# EAGLE design Öffnungsmelder-101 (EAGLE 4.91)
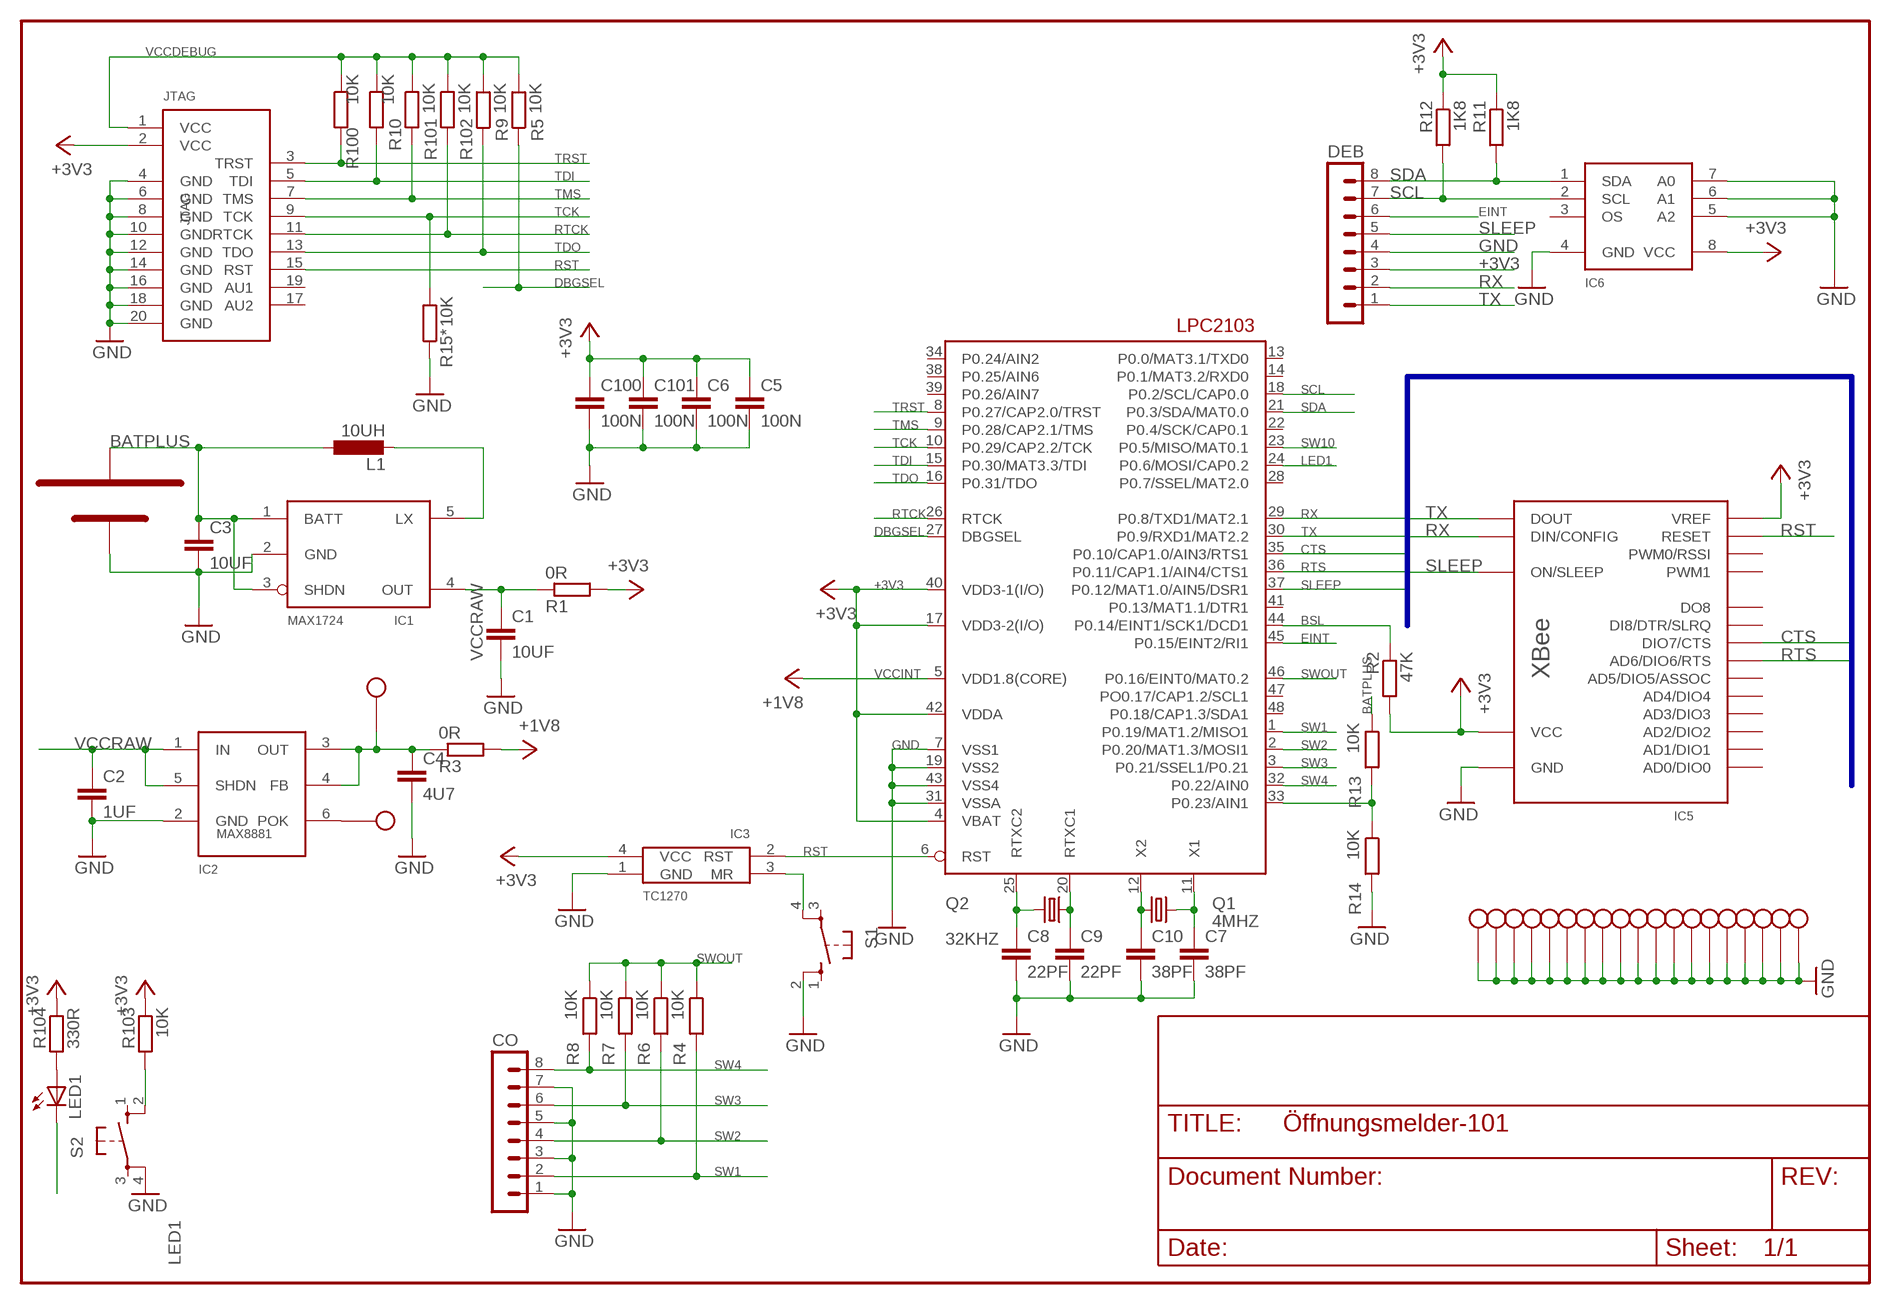
[diagram p0: schematic, sheet 1]

## Parts
$$GND1  STITCHVIA  [STITCHVIA]
$$GND2  STITCHVIA  [STITCHVIA]
$$GND3  STITCHVIA  [STITCHVIA]
$$GND4  STITCHVIA  [STITCHVIA]
$$GND5  STITCHVIA  [STITCHVIA]
$$GND6  STITCHVIA  [STITCHVIA]
$$GND7  STITCHVIA  [STITCHVIA]
$$GND8  STITCHVIA  [STITCHVIA]
$$GND9  STITCHVIA  [STITCHVIA]
$$GND10  STITCHVIA  [STITCHVIA]
$$GND11  STITCHVIA  [STITCHVIA]
$$GND12  STITCHVIA  [STITCHVIA]
$$GND13  STITCHVIA  [STITCHVIA]
$$GND14  STITCHVIA  [STITCHVIA]
$$GND15  STITCHVIA  [STITCHVIA]
BAT  BATTERY_SINGLECELL  [BATTERYHOLDER_AA_SINGLE]
C1  10UF  C-EUC0805  [C0805]
C2  1UF  C-EUC0805  [C0805]
C3  10UF  C-EUC0805  [C0805]
C4  4U7  C-EUC0805  [C0805]
C5  100N  C-EUC0805  [C0805]
C6  100N  C-EUC0805  [C0805]
C7  38PF  C-EUC0603  [C0603]
C8  22PF  C-EUC0805  [C0805]
C9  22PF  C-EUC0805  [C0805]
C10  38PF  C-EUC0603  [C0603]
C100  100N  C-EUC0805  [C0805]
C101  100N  C-EUC0805  [C0805]
CO  MA08-1  [MA08-1]
DEB  MA08-1  [MA08-1]
GND  STITCHVIA  [STITCHVIA]
IC1  MAX1724  [SOT23-5L]
IC2  MAX8881  [SOT23-6L]
IC3  TC1270  [SOT143R_INFINEON]
IC4  LPC2103  [LQFP48]
IC5  XBEE  [XBEE]
IC6  SE95  [MSOP8]
JTAG  ARM-JTAGVERTIKAL  [ML20]
L1  10UH  L-EU  [L2634MURATA]
LED1  LEDCHIP-LED0805  [CHIP-LED0805]
Q1  4MHZ  CRYTALHC49S  [HC49/S]
Q2  32KHZ  CRYTALTC26V  [TC26V]
R1  0R  R-EU_M0805  [M0805]
R2  47K  R-EU_M0805  [M0805]
R3  0R  R-EU_M0805  [M0805]
R4  10K  R-EU_M0805  [M0805]
R5  10K  R-EU_M0805  [M0805]
R6  10K  R-EU_M0805  [M0805]
R7  10K  R-EU_M0805  [M0805]
R8  10K  R-EU_M0805  [M0805]
R9  10K  R-EU_M0805  [M0805]
R10  10K  R-EU_M0805  [M0805]
R11  1K8  R-EU_M0805  [M0805]
R12  1K8  R-EU_M0805  [M0805]
R13  10K  R-EU_M0805  [M0805]
R14  10K  R-EU_M0805  [M0805]
R15*  10K  R-EU_M0805  [M0805]
R100  10K  R-EU_M0805  [M0805]
R101  10K  R-EU_M0805  [M0805]
R102  10K  R-EU_M0805  [M0805]
R103  10K  R-EU_M0805  [M0805]
R104  330R  R-EU_M0805  [M0805]
S1  10XX  [B3F-10XX]
S2  10XX  [B3F-10XX]
U$1  STITCHVIA  [STITCHVIA]
U$2  STITCHVIA  [STITCHVIA]
U$3  STITCHVIA  [STITCHVIA]
U$4  STITCHVIA  [STITCHVIA]
U$5  STITCHVIA  [STITCHVIA]

## Nets
+3V3: C5.1 C6.1 C100.1 C101.1 DEB.3 IC3.4(VCC) IC4.4(VBAT) IC4.17(VDD3-2(I/O)) IC4.40(VDD3-1(I/O)) IC4.42(VDDA) IC5.1(VCC) IC5.14(VREF) IC6.8(VCC) JTAG.2(VCC) R1.2 R2.2 R11.1 R12.1 R103.1 R104.1
BATPLUS: BAT.VCC C3.1 IC1.1(BATT) IC1.3(SHDN) L1.P$1 R13.1
BSL: IC4.44(P0.14/EINT1/SCK1/DCD1) R2.1
CTS: IC4.35(P0.10/CAP1.0/AIN3/RTS1) IC5.12(DIO7/CTS)
DBGSEL: IC4.27(DBGSEL) R5.1
EINT: DEB.6 IC4.45(P0.15/EINT2/RI1)
GND: $$GND1.1(GND) $$GND2.1(GND) $$GND3.1(GND) $$GND4.1(GND) $$GND5.1(GND) $$GND6.1(GND) $$GND7.1(GND) $$GND8.1(GND) $$GND9.1(GND) $$GND12.1(GND) $$GND13.1(GND) $$GND14.1(GND) $$GND15.1(GND) BAT.GND C1.2 C2.2 C3.2 C4.2 C5.2 C6.2 C7.2 C8.2 C9.2 C10.2 C100.2 C101.2 CO.1 CO.3 CO.5 CO.7 DEB.4 GND.1(GND) IC1.2(GND) IC2.2(GND) IC3.1(GND) IC4.7(VSS1) IC4.19(VSS2) IC4.31(VSSA) IC4.43(VSS4) IC5.10(GND) IC6.4(GND) IC6.5(A2) IC6.6(A1) IC6.7(A0) JTAG.4(GND) JTAG.6(GND) JTAG.8(GND) JTAG.10(GND) JTAG.12(GND) JTAG.14(GND) JTAG.16(GND) JTAG.18(GND) JTAG.20(GND) R14.2 R15*.1 S1.2 S2.4 U$1.1(GND) U$2.1(GND) U$3.1(GND) U$4.1(GND) U$5.1(GND)
LED1: IC4.24(P0.6/MOSI/CAP0.2) LED1.C
LX: IC1.5(LX) L1.P$2
MANRST: IC3.3(MR) S1.4
N$1: IC4.33(P0.23/AIN1) R13.2 R14.1
N$2: $$GND11.1(GND) IC2.6(POK)
N$14: LED1.A R104.2
RST: IC3.2(RST) IC4.6(RST) IC5.5(RESET) JTAG.15(RST)
RTCK: IC4.26(RTCK) JTAG.11(RTCK) R102.2
RTS: IC4.36(P0.11/CAP1.1/AIN4/CTS1) IC5.16(AD6/DIO6/RTS)
RTXC1: C9.1 IC4.20(RTXC1) Q2.1
RTXC2: C8.1 IC4.25(RTXC2) Q2.2
RX: DEB.2 IC4.29(P0.8/TXD1/MAT2.1) IC5.3(DIN/CONFIG)
SCL: DEB.7 IC4.18(P0.2/SCL/CAP0.0) IC6.2(SCL) R12.2
SDA: DEB.8 IC4.21(P0.3/SDA/MAT0.0) IC6.1(SDA) R11.2
SLEEP: DEB.5 IC4.37(P0.12/MAT1.0/AIN5/DSR1) IC5.13(ON/SLEEP)
SW1: CO.2 IC4.1(P0.19/MAT1.2/MISO1) R4.2
SW2: CO.4 IC4.2(P0.20/MAT1.3/MOSI1) R6.2
SW3: CO.6 IC4.3(P0.21/SSEL1/P0.21) R7.2
SW4: CO.8 IC4.32(P0.22/AIN0) R8.2
SW10: IC4.23(P0.5/MISO/MAT0.1) R103.2 S2.2
SWOUT: IC4.46(P0.16/EINT0/MAT0.2) R4.1 R6.1 R7.1 R8.1
TCK: IC4.10(P0.29/CAP2.2/TCK) JTAG.9(TCK) R15*.2
TDI: IC4.15(P0.30/MAT3.3/TDI) JTAG.5(TDI) R10.2
TDO: IC4.16(P0.31/TDO) JTAG.13(TDO) R9.1
TMS: IC4.9(P0.28/CAP2.1/TMS) JTAG.7(TMS) R101.2
TRST: IC4.8(P0.27/CAP2.0/TRST) JTAG.3(TRST) R100.2
TX: DEB.1 IC4.30(P0.9/RXD1/MAT2.2) IC5.2(DOUT)
VCCDEBUG: JTAG.1(VCC) R5.2 R9.2 R10.1 R100.1 R101.1 R102.1
VCCINT: IC4.5(VDD1.8(CORE)) R3.2 ; supply symbol labelled +1V8
VCCINTREG: $$GND10.1(GND) C4.1 IC2.3(OUT) IC2.4(FB) R3.1
VCCRAW: C1.1 C2.1 IC1.4(OUT) IC2.1(IN) IC2.5(SHDN) R1.1
X1: C7.1 IC4.11(X1) Q1.2
X2: C10.1 IC4.12(X2) Q1.1
Unconnected: IC4.13(P0.0/MAT3.1/TXD0) IC4.14(P0.1/MAT3.2/RXD0) IC4.22(P0.4/SCK/CAP0.1) IC4.28(P0.7/SSEL/MAT2.0) IC4.34(P0.24/AIN2) IC4.38(P0.25/AIN6) IC4.39(P0.26/AIN7) IC4.41(P0.13/MAT1.1/DTR1) IC4.47(PO0.17/CAP1.2/SCL1) IC4.48(P0.18/CAP1.3/SDA1) IC5.4(DO8) IC5.6(PWM0/RSSI) IC5.7(PWM1) IC5.9(DI8/DTR/SLRQ) IC5.11(AD4/DIO4) IC5.15(AD5/DIO5/ASSOC) IC5.17(AD3/DIO3) IC5.18(AD2/DIO2) IC5.19(AD1/DIO1) IC5.20(AD0/DIO0) IC6.3(OS) JTAG.17(AU2) JTAG.19(AU1) S1.1 S1.3 S2.1 S2.3

## Buses
SLEEP,RX,TX,CTS,RTS

## Library data of the parts
$$GND1-$$GND15 GND U$1-U$5 = turbod3:STITCHVIA
BAT = turbod3:BATTERY_SINGLECELL
C1-C10 C100 C101 = turbod3:C-EU: CAPACITOR, European symbol
CO DEB = con-lstb:MA08-1: PIN HEADER
IC1 = turbod3:MAX1724
IC2 = turbod3:MAX8881
IC3 = turbod3:TC1270
IC4 = turbod3:LPC2103: LPC2101/2102/2103 microcontroler from Philips
IC5 = turbod3:XBEE
IC6 = turbod3:SE95
JTAG = turbod3:ARM-JTAG
L1 = turbod3:L-EU: INDUCTOR, European symbol
LED1 = led:LED: LED OSRAM: - CHIPLED LG R971, LG N971, LY N971, LG Q971, LY Q971, LO R971, LY R971 LH N974, LH R974 LS Q976, LO Q976, LY Q976 LO Q996 - Hyper CHIPLED LW Q18S LB Q993, LB Q99A, LB R99A - SideLED LS A670, LO A670, LY A670, LG A670, LP A670 LB A673, LV A673, LT A673, LW A673 LH A674 LY A675 LS A676, LA A676, LO A676, LY A676, LW A676 LS A679, LY A679, LG A679 - Hyper Micro SIDELED® LS Y876, LA Y876, LO Y876, LY Y876 LT Y87S - SmartLED LW L88C, LW L88S LB L89C, LB L89S, LG L890 LS L89K, LO L89K, LY L89K LS L896, LA L896, LO L896, LY L896 - TOPLED LS T670, LO T670, LY T670, LG T670, LP T670 LSG T670, LSP T670, LSY T670, LOP T670, LYG T670 LG T671, LOG T671, LSG T671 LB T673, LV T673, LT T673, LW T673 LH T674 LS T676, LA T676, LO T676, LY T676, LB T676, LH T676, LSB T676, LW T676 LB T67C, LV T67C, LT T67C, LS T67K, LO T67K, LY T67K, LW E67C LS E67B, LA E67B, LO E67B, LY E67B, LB E67C, LV E67C, LT E67C LW T67C LS T679, LY T679, LG T679 LS T770, LO T770, LY T770, LG T770, LP T770 LB T773, LV T773, LT T773, LW T773 LH T774 LS E675, LA E675, LY E675, LS T675 LS T776, LA T776, LO T776, LY T776, LB T776 LHGB T686 LT T68C, LB T68C - Hyper Mini TOPLED® LB M676 - Mini TOPLED Santana® LG M470 LS M47K, LO M47K, LY M47K Source: http://www.osram.convergy.de/
Q1 Q2 = turbod3:CRYTAL: CRYSTAL
R1-R14 R15* R100-R104 = turbod3:R-EU_: RESISTOR, European symbol
S1 S2 = KEY_B:10XX

## Board
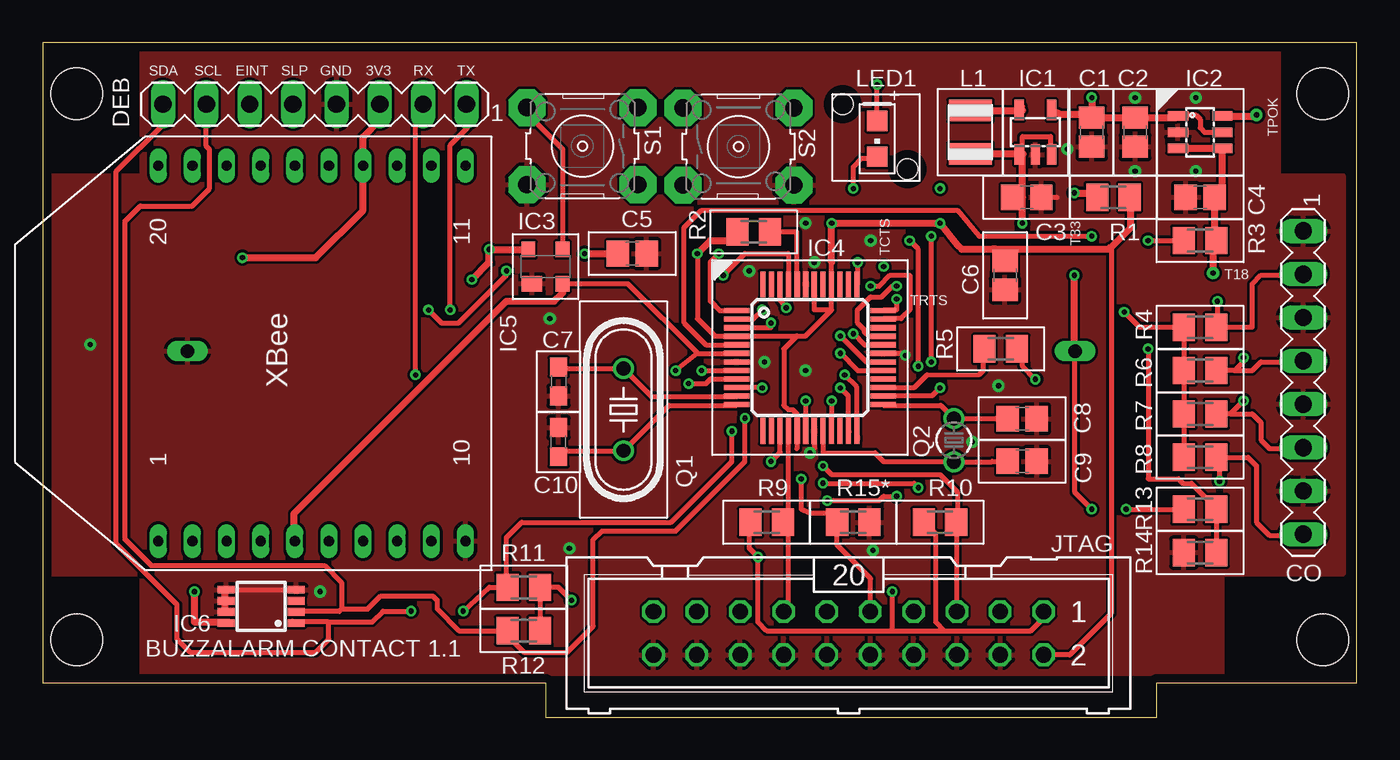
[diagram p1: board, top side]
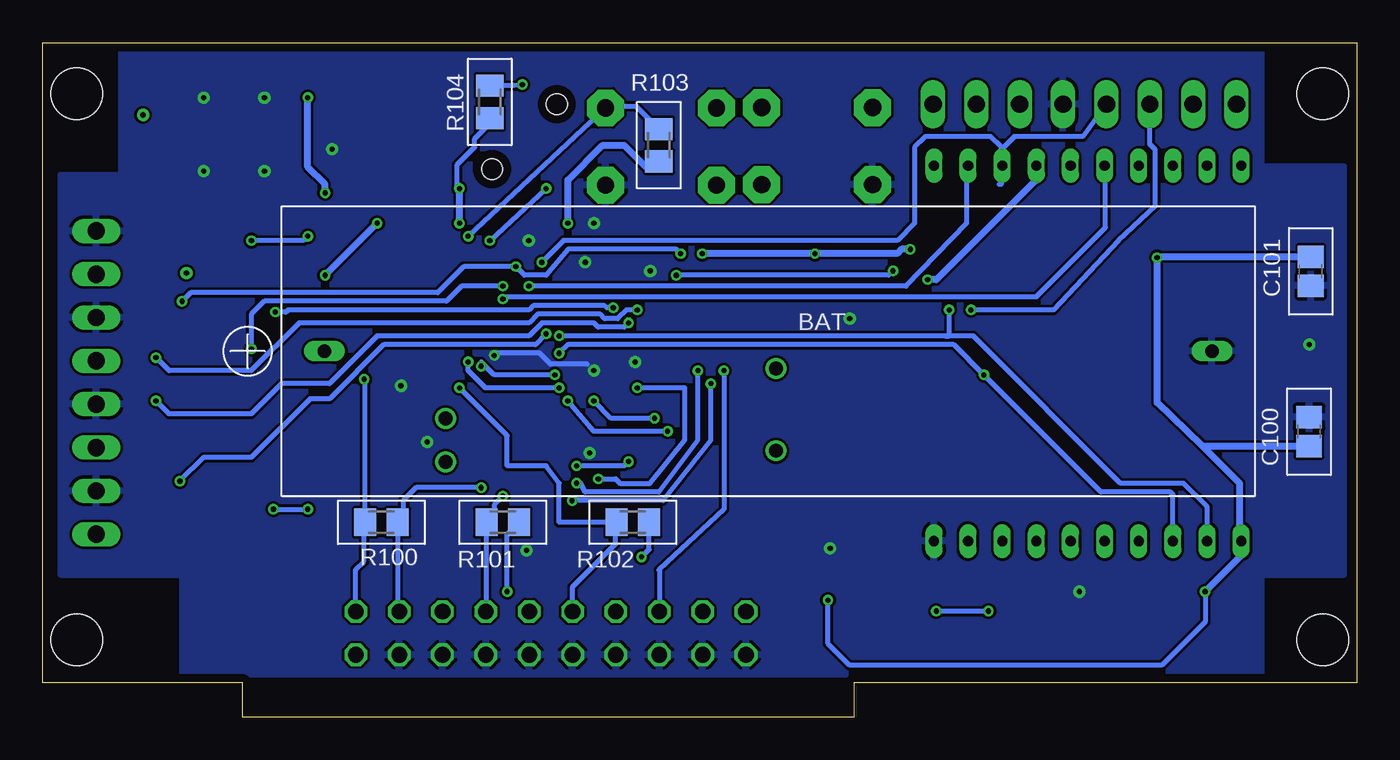
[diagram p2: board, bottom side, seen from below]

Size 77 x 39.54 mm. Coordinates in mm from the lower left corner, seen from the top.
Outline: 0,2.03 29.46,2.03 29.46,0 65.28,0 65.28,2.03 77,2.03 77,39.54 0,39.54 0,2.03
Copper layers (1*16): Top 0.035mm / dielectric 1.5mm / Bottom 0.035mm
Design rules "PCB-POOL": minimum track width 6mil, minimum drill 12mil, track to track 6mil, track to pad 6mil, pad to pad 6mil, via to via 6mil, smd to smd 6mil, copper to edge 20mil, drill to drill 8mil, minimum pad ring 8mil, minimum via ring 6mil, stop-mask expansion 3mil, vias tented up to drill 0mil, thermal gap 8mil
Holes 3 mm at 2,36.54 2,4.54 75,36.54 75,4.54

### Footprints (pad centres in the part's own frame; a part is rotated, then mirrored left to right if it is on the bottom)
STITCHVIA = drill 0.305 pad 0.61 round: 1 0,0
BATTERYHOLDER_AA_SINGLE = drill 0.8 pad 1 long: GND -26.5,0.5; VCC 25.5,0.5
C0805 = smd 1.3 x 1.5: 1 -0.85,0; 2 0.85,0
C0603 = smd 1.1 x 1: 1 -0.85,0; 2 0.85,0
MA08-1 = drill 1.016 long: 1 -8.89,0; 2 -6.35,0; 3 -3.81,0; 4 -1.27,0; 5 1.27,0; 6 3.81,0; 7 6.35,0; 8 8.89,0
SOT23-5L = smd 0.55 x 1.2: 1 -0.95,-1.3; 2 0,-1.3; 3 0.95,-1.3; 4 0.95,1.3; 5 -0.95,1.3
SOT23-6L = smd 0.55 x 1.2: 1 -0.95,-1.3; 2 0,-1.3; 3 0.95,-1.3; 4 0.95,1.3; 5 0,1.3; 6 -0.95,1.3
SOT143R_INFINEON = smd 1.2 x 0.9: 1 -0.8,-1 | smd 0.8 x 0.9: 2 1,-1; 3 1,1; 4 -1,1
LQFP48 = smd 1.5 x 0.3: 1 -4.3,2.75; 2 -4.3,2.25; 3 -4.3,1.75; 4 -4.3,1.25; 5 -4.3,0.75; 6 -4.3,0.25; 7 -4.3,-0.25; 8 -4.3,-0.75; 9 -4.3,-1.25; 10 -4.3,-1.75; 11 -4.3,-2.25; 12 -4.3,-2.75; 25 4.3,-2.75; 26 4.3,-2.25; 27 4.3,-1.75; 28 4.3,-1.25; 29 4.3,-0.75; 30 4.3,-0.25; 31 4.3,0.25; 32 4.3,0.75; 33 4.3,1.25; 34 4.3,1.75; 35 4.3,2.25; 36 4.3,2.75 | smd 0.3 x 1.5: 13 -2.75,-4.3; 14 -2.25,-4.3; 15 -1.75,-4.3; 16 -1.25,-4.3; 17 -0.75,-4.3; 18 -0.25,-4.3; 19 0.25,-4.3; 20 0.75,-4.3; 21 1.25,-4.3; 22 1.75,-4.3; 23 2.25,-4.3; 24 2.75,-4.3; 37 2.75,4.3; 38 2.25,4.3; 39 1.75,4.3; 40 1.25,4.3; 41 0.75,4.3; 42 0.25,4.3; 43 -0.25,4.3; 44 -0.75,4.3; 45 -1.25,4.3; 46 -1.75,4.3; 47 -2.25,4.3; 48 -2.75,4.3
XBEE = drill 0.6 long: 1 -11,17; 2 -11,15; 3 -11,13; 4 -11,11; 5 -11,9; 6 -11,7; 7 -11,5; 8 -11,3; 9 -11,1; 10 -11,-1; 11 11,-1; 12 11,1; 13 11,3; 14 11,5; 15 11,7; 16 11,9; 17 11,11; 18 11,13; 19 11,15; 20 11,17
MSOP8 = smd 0.45 x 1: 1 -0.975,-2.05; 2 -0.325,-2.05; 3 0.325,-2.05; 4 0.975,-2.05; 5 0.975,2.05; 6 0.325,2.05; 7 -0.325,2.05; 8 -0.975,2.05
ML20 = drill 0.914 octagon: 1 -11.43,-1.27; 2 -11.43,1.27; 3 -8.89,-1.27; 4 -8.89,1.27; 5 -6.35,-1.27; 6 -6.35,1.27; 7 -3.81,-1.27; 8 -3.81,1.27; 9 -1.27,-1.27; 10 -1.27,1.27; 11 1.27,-1.27; 12 1.27,1.27; 13 3.81,-1.27; 14 3.81,1.27; 15 6.35,-1.27; 16 6.35,1.27; 17 8.89,-1.27; 18 8.89,1.27; 19 11.43,-1.27; 20 11.43,1.27
L2634MURATA = smd 1.27 x 2.54: P$1 -1.27,0; P$2 1.27,0
CHIP-LED0805 = smd 1.2 x 1.2: A 0,-1.05; C 0,1.05
HC49/S = drill 0.813 round: 1 -2.413,0; 2 2.413,0
TC26V = drill 0.813 round: 1 -1.27,0; 2 1.27,0
M0805 = smd 1.3 x 1.6: 1 -0.95,0; 2 0.95,0
B3F-10XX = drill 1.016 pad 2.159 octagon: 1 -3.379,2.312; 2 3.123,2.312; 3 -3.379,-2.209; 4 3.123,-2.209
LIGHTPIPE1 = hole 1.2: -2.4,2.4; 1.4,-1.4

### Placement (x,y rotation side)
$$GND1  64.01,36.32 0 top
$$GND2  67.56,36.32 0 top
$$GND3  60.04,33.3 90 top
$$GND4  64.01,32 90 top
$$GND5  67.56,32 90 top
$$GND6  44.7,20.32 0 top
$$GND7  54.48,16.13 0 top
$$GND8  30.86,9.91 0 top
$$GND9  48.64,9.78 0 top
$$GND10  68.58,26.04 0 top
$$GND11  71.12,35.31 0 top
$$GND12  41.4,26.16 0 top
$$GND13  45.21,26.67 0 top
$$GND14  29.72,23.37 0 top
$$GND15  48.51,27.94 0 top
BAT  34.99,21.95 180 bottom
C1  61.47,34.29 270 top
C2  64.01,34.29 270 top
C3  57.66,30.48 0 top
C4  67.82,30.48 180 top
C5  34.54,27.18 0 top
C6  56.39,25.91 270 top
C7  30.23,19.68 270 top
C8  57.39,17.5 0 top
C9  57.39,15.01 0 top
C10  30.23,16.13 90 top
C100  2.8,16.74 90 bottom
C101  2.7,26.14 270 bottom
CO  73.86,19.62 270 top
DEB  15.94,35.93 180 top
GND  44.96,15.49 0 top
IC1  58.17,34.29 0 top
IC2  67.82,34.29 270 top
IC3  29.46,26.42 0 top
IC4  44.96,21.08 0 top
IC5  23.77,21.33 90 top
IC6  12.8,6.5 90 top
JTAG  47.22,4.93 180 top
L1  54.36,34.29 90 top
LED1  48.9,33.91 180 top
Q1  34.04,18.03 90 top
Q2  53.39,16.24 90 top
R1  62.74,30.48 0 top
R2  41.66,28.45 180 top
R3  67.82,27.94 180 top
R4  67.82,22.86 0 top
R5  56.13,21.59 0 top
R6  67.82,20.32 0 top
R7  67.82,17.78 0 top
R8  67.82,15.24 0 top
R9  42.42,11.43 180 top
R10  52.58,11.43 0 top
R11  28.19,7.62 180 top
R12  28.19,5.08 180 top
R13  67.82,12.19 0 top
R14  67.82,9.65 180 top
R15*  47.5,11.43 180 top
R100  57.15,11.43 0 bottom
R101  50.04,11.43 180 bottom
R102  42.42,11.43 180 bottom
R103  40.89,33.53 90 bottom
R104  50.8,36.07 90 bottom
S1  31.5,33.53 180 top
S2  40.89,33.4 0 top
U$1  44.7,28.96 0 top
U$2  42.29,20.83 0 top
U$3  2.79,21.84 0 top
U$4  56.01,19.43 0 top
U$5  16.26,7.37 0 top
U$6  [LIGHTPIPE1]  49.28,33.53 0 top

### Tracks (layer width: path | path; a pad name or v marks a point on that pad's centre or on a via)
+3V3  (via drill 0.3)
  Top 0.305: 46.23,23.88 44.7,22.35 44.2,22.35 | IC4.42 45.21,25.4 | IC4.42 | IC4.42 | IC4.42 45.21,23.88 46.23,23.88 | IC4.40 46.23,25.4 | 46.23,23.88 46.23,25.4 | 44.2,22.35 40.68,22.35 IC4.4 39.39,22.33 38.35,23.37 v38.35,27.18 | 44.2,16.79 IC4.17 44.2,16.77 | 44.2,16.77 44.2,16.76 | 44.2,16.77 44.2,17.78 43.94,18.03 43.69,18.03 43.43,18.29 43.43,21.59 44.2,22.35 | 44.2,16.77 44.2,15.75 | 46.23,25.4 46.23,26.67 | R12.1 29.21,5.33 29.14,5.4 R11.1 30.23,7.62 v30.99,6.86 | JTAG.2 60.17,3.66 62.61,6.1 62.61,27.43 62.55,27.5 62.48,27.56 | 26.18,27.42 26.18,27.19 v26.16,27.43
  Top 0.406: 46.23,26.67 v46.23,28.96 v52.58,28.96 53.59,27.69 53.85,27.43 55.88,27.43 | v31.75,27.18 C5.1 | DEB.3 19.75,35.11 19.81,35.05 18.77,34.01 18.77,31.47 | 18.77,31.47 IC5.14 | 18.77,31.47 18.77,29.7 16,26.94 v11.7,26.94 | v8.89,7.37 8.89,5.59 10.92,5.59 10.86,5.53 IC6.8 | v38.35,27.18 39.12,27.94 40.64,27.94 40.71,28.01 R2.2 | 55.88,27.43 62.48,27.43 62.55,27.5 63.75,28.7 63.75,30.48 R1.2 | 55.88,27.43 55.63,27.43 | 26.18,27.42 IC3.4 | v26.16,27.43 26.16,26.67 v25.15,25.65 | C6.1 56.39,26.92 55.88,27.43
  Bottom 0.305: v30.99,6.86 30.99,4.32 29.72,3.05 11.43,3.05 8.89,5.59 v8.89,7.37 | v52.58,30.99 52.7,30.86 52.7,32.38 51.69,33.4 51.69,33.91 50.93,34.67 50.87,34.61 R104.1
  Bottom 0.406: v52.58,28.96 v52.58,30.99 | v46.23,28.96 46.23,31.5 44.2,33.53 42.93,33.53 41.66,32.26 41.15,32.26 40.89,32.51 R103.1 | v26.16,27.43 26.67,27.43 26.92,27.18 v31.75,27.18 v38.35,27.18 | IC5.14 18.77,31.47 18.8,31.5 24.64,25.65 v25.15,25.65 | v8.89,7.37 6.77,9.48 IC5.1 6.86,10.41 6.86,13.72 9.06,15.91 | 9.06,15.91 C100.1 | 9.06,15.91 11.7,18.44 v11.7,26.94 11.7,26.99 C101.1
BATPLUS  (via drill 0.3, 0.3 pad 0.61)
  Top 0.305: 57.44,33.02 IC1.1 57.4,32.92 | 57.4,32.99 57.4,34.04 59.05,34.04 59.05,32.99 | BAT.VCC 60.49,13.17 v61.47,12.19 | 66.93,12.19 R13.1 v63.48,12.19 | 59.05,32.99 59.05,32.77 | 59.05,32.99 IC1.3
  Top 0.406: 57.44,33.02 L1.P$1 | 57.4,30.48 57.4,32.92 | 57.4,30.48 C3.1 | v57.4,28.96 57.4,30.48 | IC1.1 57.4,32.99 | BAT.VCC 60.49,21.55 60.45,21.59 v60.45,25.91
  Bottom 0.305: v63.48,12.19 v61.47,12.19
  Bottom 0.406: v60.45,25.91 v57.4,28.96
BSL
  Top 0.305: IC4.44 44.2,25.39 44.2,28.45 R2.1
CTS  (via drill 0.3)
  Top 0.305: IC4.35 49.28,23.35 49.28,23.37 50.29,23.37 50.8,23.88 50.8,25.91 49.66,25.91 49.02,25.27 v48.51,25.27
  Bottom 0.305: IC5.12 22.86,31.35 22.86,28.96 26.42,25.27 v48.51,25.27
DBGSEL
  Top 0.305: IC4.27 51.08,19.33 51.82,20.07 54.89,20.09 55.12,20.32 55.12,21.84 R5.1
EINT  (via drill 0.3)
  Top 0.305: IC4.45 43.71,26.4 43.69,27.18 41.15,27.18 v39.88,25.91 | 12.19,35.81 12.13,35.88 DEB.6 | v27.18,26.16 27.18,25.91 24.38,23.11 23.37,23.11 v22.61,23.88
  Bottom 0.305: v39.88,25.91 27.43,25.91 v27.18,26.16 | DEB.6 12.13,33.59 11.81,33.27 11.81,29.97 13.97,27.94 17.78,23.88 v22.61,23.88
GND  (via drill 0.3)
  Top 0.305: C3.2 59.44,30.48 | IC6.5 14.94,7.48 | C1.2 61.47,33.53 60.86,32.92 | IC4.19 45.21,15.75 | IC4.31 50.67,21.33 v50.55,21.21
  Top 0.406: 14.94,7.42 14.88,7.48 IC6.4 14.94,7.48 | 10.67,6.83 10.67,6.81 | IC6.5 10.67,7.48 10.67,6.83 | IC6.7 10.67,6.18 10.67,6.83 | 10.67,6.83 IC6.6
  Bottom 0.305: v50.55,21.21 50.42,21.21 50.29,21.34 47.88,21.34 47.24,20.7 45.09,20.7
  pour Top: 0.51,31.75 5.84,31.75 5.84,39.08 72.39,39.08 72.39,31.75 76.2,31.75 76.2,8.38 69.09,8.38 69.09,2.54 5.84,2.54 5.84,8.38 0.51,8.38
  pour Bottom: 0.76,8.38 0.76,32.26 5.59,32.26 5.59,39.08 72.39,39.08 72.39,31.75 75.95,31.75 75.95,8.38 68.83,8.38 68.83,2.54 5.59,2.54 5.59,8.38 6.35,8.38
LED1  (via drill 0.3, 0.3 pad 0.61)
  Top 0.305: 47.73,16.26 IC4.24 47.71,19.35 v46.99,20.07 | v47.5,30.99 47.5,32.26 48.01,32.77 48.77,32.77 48.86,32.86 LED1.C | v50.8,27.94 51.31,27.43 v51.31,20.57
  Bottom 0.305: v50.8,27.94 v47.5,30.99 | v46.99,20.07 50.55,20.07 51.31,20.83 v51.31,20.57
LX
  Top 0.305: 57.4,35.66 IC1.5 | 57.4,35.66 57.4,35.81 | 57.4,35.56 57.4,35.66
  Top 0.406: L1.P$2 57.4,35.56
MANRST
  Top 0.305: IC3.3 30.48,27.43 30.48,33.27 28.45,35.31 28.45,35.81 | 28.45,35.81 | 28.45,35.81 S1.4
N$1  (via drill 0.3)
  Top 0.305: v64.77,21.59 64.77,13.97 66.55,13.97 66.8,13.72 67.31,13.72 68.83,12.19 R13.2 68.77,9.72 68.83,9.65 R14.1 | v50.04,25.27 49.78,25.27 49.15,24.64 48.51,24.64 47.75,23.88 47.75,23.11 48.13,22.73 48.13,22.61 48.41,22.33 IC4.33
  Bottom 0.305: v64.77,21.59 64.77,23.62 64.01,24.38 53.34,24.38 52.45,25.27 v50.04,25.27
N$2
  Top 0.406: 71.12,35.24 $$GND11.1 | IC2.6 71.12,35.24 | 71.12,35.24 71.12,35.18
N$14  (via drill 0.3)
  Top 0.305: LED1.A v48.9,37.08
  Bottom 0.305: R104.2 49.4,37.02 v48.9,37.08
RST  (via drill 0.3)
  Top 0.305: 38.35,21.33 IC4.6 | 38.35,21.33 v37.08,20.32 | 38.35,21.33 38.35,21.34 34.27,25.42 IC3.2
  Top 0.406: IC3.2 30.46,24.88 29.97,24.38 27.18,24.38 14.73,11.94 14.73,10.41 14.77,10.37 IC5.5
  Bottom 0.305: 40.87,8.66 40.89,8.64 | 40.87,8.66 JTAG.15 | v37.08,20.32 37.08,12.19 40.87,8.66
RTCK  (via drill 0.3)
  Top 0.305: IC4.26 52.11,18.83 v52.58,19.3
  Bottom 0.305: JTAG.11 45.95,7.64 43.43,10.16 43.43,11.43 | 43.43,11.43 R102.2 | v52.58,19.3 49.78,16.51 49.78,14.73 47.5,14.73 46.74,13.72 46.74,11.43 43.43,11.43
RTS  (via drill 0.3)
  Top 0.305: IC4.36 49.3,23.88 50.04,23.88 v50.04,24.51
  Bottom 0.305: IC5.16 14.73,31.39 14.73,28.7 18.8,24.64 49.91,24.64 v50.04,24.51
RTXC1
  Top 0.305: IC4.20 45.72,15.49 48.77,15.49 49.28,14.99 52.9,14.99 Q2.1 55.61,14.97 55.65,15.01 C9.1
RTXC2
  Top 0.305: IC4.25 49.28,18.31 49.28,18.29 52.62,18.29 Q2.2 55.87,17.51 | 55.87,17.51 55.85,17.5 C8.1 | 55.87,17.51 55.88,17.53
RX  (via drill 0.3)
  Top 0.305: 22.29,35.24 22.35,35.31 | 22.29,35.24 DEB.2 | v21.84,20.07 21.84,34.8 22.29,35.24 | IC4.29 49.28,20.32 | IC4.29 | v46.74,21.34 47.75,20.32 IC4.29
  Bottom 0.305: IC5.3 10.77,13.06 10.92,13.21 14.99,13.21 v21.84,20.07 23.62,21.84 46.23,21.84 v46.74,21.34
SCL  (via drill 0.3)
  Top 0.305: R12.2 24.38,5.08 23.11,6.35 23.11,6.86 22.86,7.11 19.81,7.11 19.05,6.35 17.53,6.35 | 17.53,6.35 17.37,6.2 14.83,6.2 | 27.24,4.76 28.19,3.81 30.73,3.81 32.26,5.33 32.26,10.41 32.77,10.92 37.08,10.92 41.15,14.99 v41.15,17.53 | 17.53,6.35 17.53,7.87 16.51,8.89 6.35,8.89 4.83,10.41 4.83,29.08 5.71,29.97 8.76,29.97 9.78,30.99 9.78,33.27 9.59,33.46 DEB.7 | IC4.18 v44.71,18.54 v44.7,18.54
  Top 0.406: 14.87,6.2 IC6.2 14.83,6.2 14.63,6.2 | R12.2 27.24,4.76
  Bottom 0.305: v41.15,17.53 43.69,17.53 v44.7,18.54
SDA  (via drill 0.3)
  Top 0.305: v21.59,6.22 19.94,6.22 19.3,5.59 16.76,5.59 | v24.64,6.22 26.16,7.62 R11.2 | 16.76,5.59 14.63,5.59 | v40.39,16.76 40.39,14.99 36.83,11.43 28.07,11.43 27.18,10.54 27.18,7.75 27.24,7.68 R11.2 | IC4.21 46.21,18.52 | 26.92,7.87 27.18,7.62 R11.2 | DEB.8 7.05,34.74 4.32,32 4.32,10.16 7.87,6.6 7.87,4.57 8.64,3.81 16,3.81 16.76,4.57 16.76,5.59
  Top 0.406: R11.2 27.43,7.62 | 14.63,5.59 14.69,5.53 IC6.1 | v46.23,18.54 46.21,18.52
  Bottom 0.305: v21.59,6.22 v24.64,6.22 | v40.39,16.76 44.7,16.76 v46.23,18.54
SLEEP  (via drill 0.3)
  Top 0.305: IC4.37 47.75,25.43 v47.75,26.67
  Bottom 0.305: DEB.5 16.06,34.04 20.07,34.04 20.83,33.27 | 20.83,31.24 20.97,31.24 | v47.75,26.67 46.48,27.94 26.92,27.94 25.91,28.96 25.91,33.4 25.27,34.04 21.46,34.04 20.83,33.4 20.83,33.27 | 20.83,31.24 20.83,31.38 IC5.13 20.77,32.06 20.83,32 | 20.83,32 20.83,31.24 | 20.83,33.27 20.83,32
SW1  (via drill 0.3 pad 0.61)
  Top 0.305: 68.83,22.86 70.87,22.86 70.87,25.4 71.37,25.91 73.91,25.91 CO.2 | IC4.1 39.67,23.83 39.12,24.38 39.12,26.67 v39.62,27.18 | 68.83,22.86 R4.2 | v68.83,24.38 68.83,22.86
  Bottom 0.305: v39.62,27.18 39.88,27.43 46.23,27.43 47.5,25.91 48.77,25.91 v49.28,26.42 52.32,26.42 53.85,24.89 68.33,24.89 v68.83,24.38
SW2  (via drill 0.3 pad 0.61)
  Top 0.305: 69.85,20.32 R6.2 | 69.85,20.32 70.87,20.32 71.37,20.83 73.91,20.83 CO.4 | IC4.2 41.62,23.33 v42.16,23.88 | v70.36,21.08 70.36,20.83 69.85,20.32
  Bottom 0.305: v42.16,23.88 42.8,23.88 43.31,23.37 44.07,23.37 44.32,23.62 48.01,23.62 48.51,23.11 61.98,23.11 64.77,20.32 69.6,20.32 v70.36,21.08
SW3  (via drill 0.3 pad 0.61)
  Top 0.305: 69.6,17.78 R7.2 | 69.6,17.78 70.87,17.78 71.37,17.27 71.37,16.26 71.88,15.75 73.91,15.75 CO.6 73.86,15.95 73.91,16 | IC4.3 42.64,22.83 v42.67,23.11 | v70.36,18.54 69.6,17.78
  Bottom 0.305: v42.67,23.11 42.93,22.86 44.45,22.86 44.7,23.11 47.75,23.11 48.51,22.35 57.4,22.35 60.2,19.56 62.99,19.56 64.77,17.78 69.6,17.78 v70.36,18.54
SW4  (via drill 0.3, 0.3 pad 0.61)
  Top 0.305: CO.8 74.11,10.73 74.17,10.67 71.88,10.67 71.12,11.43 71.12,14.73 70.61,15.24 R8.2 68.77,15.31 | IC4.32 48.15,21.83 v47.5,22.48 | 68.77,15.31 68.58,15.49 | v68.96,13.84 68.96,15.11 68.77,15.31
  Bottom 0.305: v47.5,22.48 48.13,21.84 57.02,21.84 60.2,18.67 61.34,18.67 64.77,15.24 67.56,15.24 v68.96,13.84
SW10  (via drill 0.3, 0.3 pad 0.61)
  Top 0.305: 47.24,16.75 IC4.23 47.21,18.83 v46.74,19.3 | v52.07,20.83 v52.07,28.19
  Bottom 0.305: R103.2 42.23,35.81 43.99,35.81 S2.2 44.02,35.74 v52.07,28.19 | v46.74,19.3 51.05,19.3 52.07,20.32 v52.07,20.83
SWOUT  (via drill 0.3 pad 0.61)
  Top 0.305: R8.1 66.87,17.71 66.8,17.78 R7.1 66.87,20.25 66.8,20.32 R6.1 66.87,22.79 66.8,22.86 R4.1 | IC4.46 43.21,24.41 v43.56,24 | v63.37,23.75 64.26,22.86 R4.1 | R4.1 67.06,22.86
  Bottom 0.305: v43.56,24 43.94,24 44.07,24.13 48.26,24.13 48.51,23.88 62.61,23.88 62.74,23.75 v63.37,23.75
TCK  (via drill 0.3)
  Top 0.305: JTAG.9 48.49,6.12 48.51,6.1 48.51,8.13 46.55,10.09 R15*.2 46.48,11.43 46.48,11.94 44.96,11.94 44.45,12.19 v44.45,13.97 | IC4.10 42.14,19.33 v42.16,19.3
  Bottom 0.305: v42.16,19.3 39.37,19.3 39.37,16.26 41.4,13.72 43.18,13.72 43.43,13.97 v44.45,13.97
TDI  (via drill 0.3)
  Top 0.305: 53.57,6.12 53.59,6.1 | 53.57,6.12 JTAG.5 | 53.57,6.12 53.53,6.16 R10.2 53.59,11.43 53.59,13.21 52.58,14.22 46.23,14.22 v45.72,14.73 | IC4.15 43.21,15.52 v42.67,14.99
  Bottom 0.305: v45.72,14.73 42.93,14.73 v42.67,14.99
TDO
  Top 0.305: IC4.16 43.69,16.76 43.69,11.43 | 43.69,11.43 R9.1 | JTAG.13 43.41,6.12 43.43,6.1 43.69,6.35 43.69,11.43
TMS  (via drill 0.3, 0.3 pad 0.61)
  Top 0.305: v37.85,19.56 38.86,19.56 39.14,19.83 IC4.9 | v45.97,12.7 49.02,12.7 49.28,12.95 v50.04,12.95
  Bottom 0.305: R101.2 51.05,11.43 51.03,11.41 JTAG.7 | v37.85,19.56 37.85,16.26 40.64,12.7 v45.97,12.7 | R101.2 50.8,11.43 | v50.04,12.95 50.55,12.45 50.55,11.43 R101.2
TRST  (via drill 0.3, 0.3 pad 0.61)
  Top 0.305: IC4.8 38.62,20.33 v38.61,20.32 | v45.72,13.72 51.05,13.72 v51.31,13.46
  Bottom 0.305: JTAG.3 56.11,6.33 56.2,6.42 R100.2 55.88,11.43 55.88,12.7 55.12,13.46 v51.31,13.46 | v38.61,20.32 38.61,16.26 40.89,13.21 45.21,13.21 45.47,13.72 v45.72,13.72
TX  (via drill 0.3)
  Top 0.305: v23.88,23.88 23.88,33.53 24.89,34.54 24.89,35.11 DEB.1 | 49.28,20.83 49.53,20.83 | 49.28,20.83 IC4.30 | v46.74,22.35 48.26,20.83 49.28,20.83
  Bottom 0.305: IC5.2 8.77,12.33 10.16,13.72 13.84,13.72 22.48,22.35 24.13,22.35 | 24.89,35.31 24.83,35.24 DEB.1 | v23.88,23.88 23.88,22.35 24.13,22.35 | 24.13,22.35 v46.74,22.35
VCCDEBUG  (via drill 0.3)
  Top 0.305: R10.1 52.32,10.73 52.32,5.59 52.83,5.08 | 52.83,5.08 57.91,5.08 58.67,5.84 58.67,6.18 JTAG.1 | 49.78,5.08 52.83,5.08 | 49.78,5.08 v49.78,7.37 | 49.78,5.08 42.42,5.08 41.91,5.59 v41.91,9.4 41.4,9.91 41.4,11.43 R9.2 | v58.17,19.81 57.4,20.57 57.4,21.59 57.15,21.84 R5.2
  Bottom 0.305: JTAG.1 58.65,8.66 58.17,9.14 58.17,11.43 R100.1 58.1,19.75 v58.17,19.81 | R101.1 49.78,10.73 v49.78,7.37 | R9.2 41.47,9.84 v41.91,9.4
VCCINT  (via drill 0.3 pad 0.61)
  Top 0.305: IC4.5 38.87,21.83 37.59,23.11 37.59,28.7 38.61,29.72 53.59,29.72 54.86,28.19 v61.47,28.19 | 67.06,27.94 R3.2 v64.77,27.94
  Bottom 0.305: v64.77,27.94 61.72,27.94 v61.47,28.19
VCCINTREG
  Top 0.406: IC2.3 69.02,33.34 69.09,33.27 69.12,33.3 IC2.4 69.12,30.76 68.83,30.48 C4.1 68.67,28.03 68.58,27.94 | 68.58,27.94 R3.1 | $$GND10.1 68.58,27.94
VCCRAW  (via drill 0.3)
  Top 0.305: 66.55,35.31 67.56,35.31 67.82,35.05 67.82,34.54 68.07,34.29 IC2.5
  Top 0.406: IC1.4 59.65,35.31 61.47,35.31 | 61.47,35.31 C1.1 63.92,35.14 64.01,35.05 C2.1 66.38,35.14 66.55,35.31 66.52,35.28 IC2.1 | v61.47,36.32 61.47,35.31 | R1.1 61.79,30.54 61.59,30.73 v60.45,30.73
  Bottom 0.406: v60.45,30.73 60.45,31.24 61.47,32.26 v61.47,36.32
X1
  Top 0.305: IC4.11 40.64,18.81 40.64,18.8 35.69,18.8 Q1.2 30.1,20.45 30.19,20.54 C7.1
X2
  Top 0.305: IC4.12 40.64,18.31 40.64,18.29 36.7,18.29 Q1.1 30.48,15.62 30.23,15.37 C10.1

### Text on the board
tNames: SDA | SCL | EINT | SLP | GND | 3V3 | RX | TX | TPOK | T33 | TCTS | T18 | TRTS | BUZZALARM CONTACT 1.1